# Altium schematic sheet MacSet-L-V2.0.0_2.SchDoc
size A4; SheetNumber: 2; SheetTotal: 3
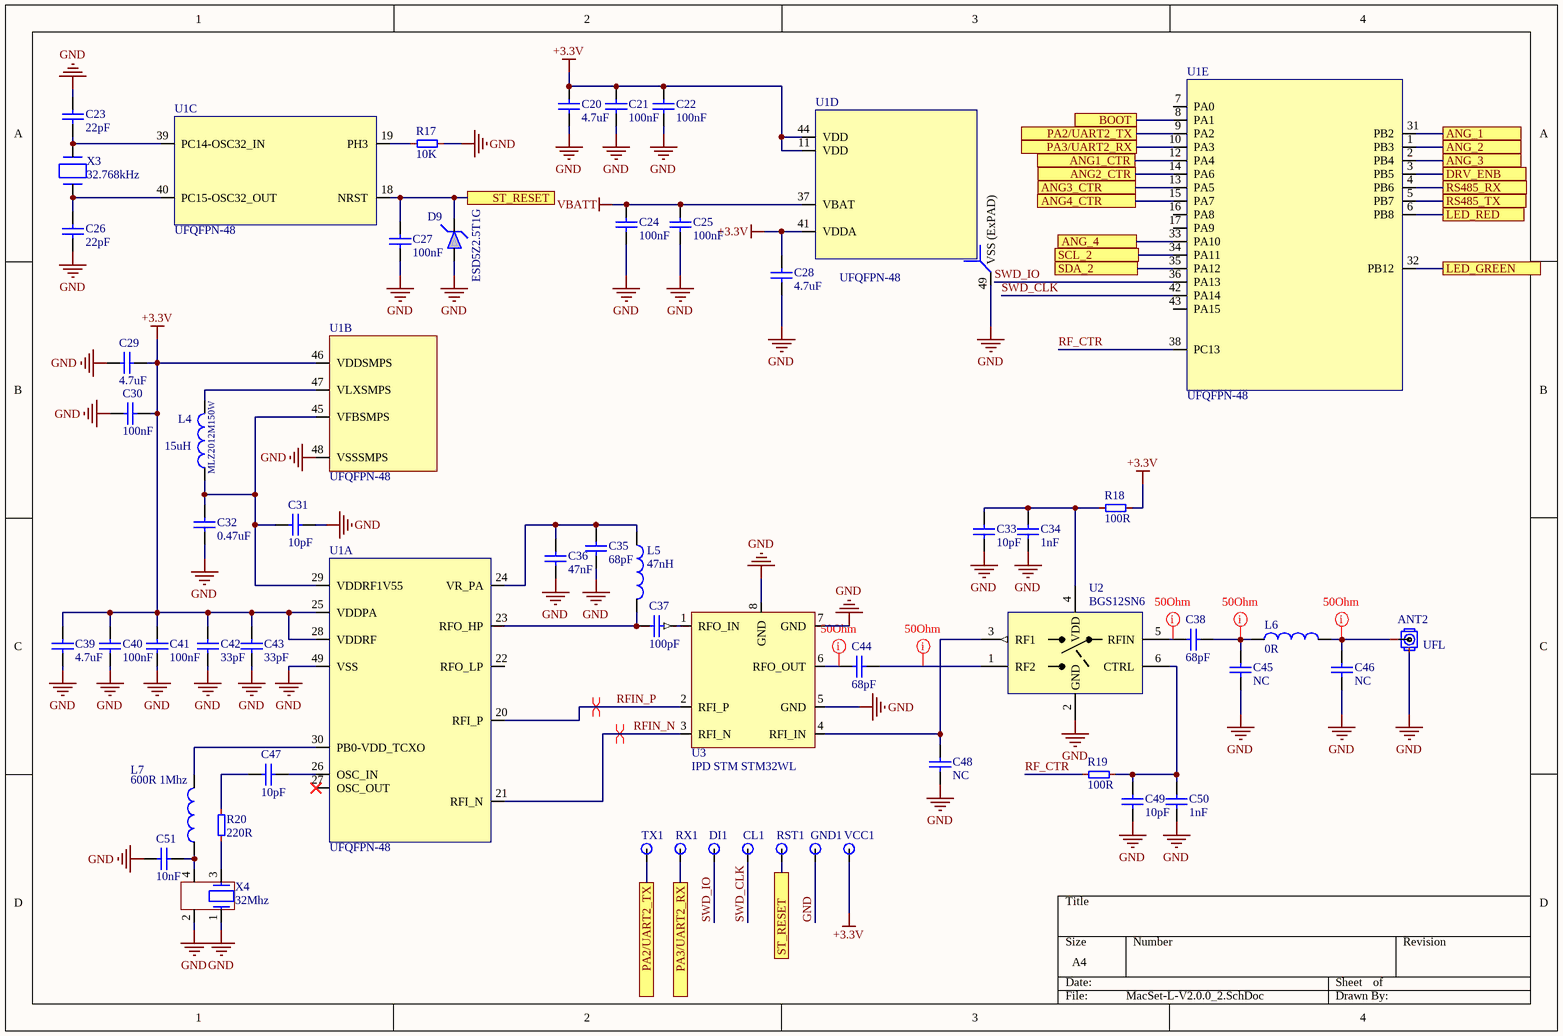
[diagram p0: MacSet-L-V2.0.0_2.SchDoc]

## Parts
ANT2  UFL  [UFL]
C20  4.7uF  [CAP0603]
C21  100nF  [CAP0402]
C22  100nF  [CAP0402]
C23  22pF  [CAP0402]
C24  100nF  [CAP0402]
C25  100nF  [CAP0402]
C26  22pF  [CAP0402]
C27  100nF  [CAP0402]
C28  4.7uF  [CAP0603]
C29  4.7uF  [CAP0603]
C30  100nF  [CAP0402]
C31  10pF  [CAP0402]
C32  0.47uF  [CAP0603]
C33  10pF  [CAP0402]
C34  1nF  [CAP0402]
C35  68pF  [CAP0402]
C36  47nF  [CAP0402]
C37  100pF  [CAP0402]
C38  68pF  [CAP0402]
C39  4.7uF  [CAP0603]
C40  100nF  [CAP0402]
C41  100nF  [CAP0402]
C42  33pF  [CAP0402]
C43  33pF  [CAP0402]
C44  68pF  [CAP0402]
C45  NC  [CAP0402]
C46  NC  [CAP0402]
C47  10pF  [CAP0402]
C48  NC  [CAP0402]  (net tie, no BOM)
C49  10pF  [CAP0402]
C50  1nF  [CAP0402]
C51  10nF  [CAP0402]
CL1  -  [TH_Pad]  (value not drawn)  (net tie, no BOM)
D9  ESD5Z2.5T1G  [SOD523]
DI1  -  [TH_Pad]  (value not drawn)  (net tie, no BOM)
GND1  -  [TH_Pad]  (value not drawn)  (net tie, no BOM)
L4  Manufacturer_Part_Number: MLZ2012M150W  [IND_2012]  (hidden comment: 15uH)
L5  47nH  [IND_0402]
L6  0R  [IND_0402]
L7  600R 1Mhz  [IND_0402]
R17  10K  [RESC0402]
R18  100R  [RESC0402]
R19  100R  [RESC0402]
R20  220R  [RESC0402]
RST1  -  [TH_Pad]  (value not drawn)  (net tie, no BOM)
RX1  -  [TH_Pad]  (value not drawn)  (net tie, no BOM)
TX1  -  [TH_Pad]  (value not drawn)  (net tie, no BOM)
U1  UFQFPN-48  [STM32WLxx_QFN48]  (parts A,B,C,D,E of 5)
U2  BGS12SN6  [SON40P70X40-6N]
U3  IPD STM STM32WL  [IPD STM]
VCC1  -  [TH_Pad]  (value not drawn)  (net tie, no BOM)
X3  32.768kHz  [OSC_3215]
X4  value 32Mhz  [OSC_2016]  (hidden comment: OSC_2016)

## Ports
ANG1_CTR (see MacSet-L-V2.0.0_1[1A]), ANG2_CTR (see MacSet-L-V2.0.0_1[1B]), ANG3_CTR (see MacSet-L-V2.0.0_1[1C]), ANG4_CTR (see MacSet-L-V2.0.0_1[1C]), ANG_1 (see MacSet-L-V2.0.0_1[2A]), ANG_2 (see MacSet-L-V2.0.0_1[2B]), ANG_3 (see MacSet-L-V2.0.0_1[2C]), ANG_4 (see MacSet-L-V2.0.0_1[2C]), BOOT (see MacSet-L-V2.0.0_1[3C]), DRV_ENB (see MacSet-L-V2.0.0_3[1A]), LED_GREEN (see MacSet-L-V2.0.0_1[3D]), LED_RED (see MacSet-L-V2.0.0_1[3D]), PA2/UART2_TX (see MacSet-L-V2.0.0_1[3C], MacSet-L-V2.0.0_2[2D]), PA2/UART2_TX (see MacSet-L-V2.0.0_1[3C], MacSet-L-V2.0.0_2[3A]), PA3/UART2_RX (see MacSet-L-V2.0.0_1[3B], MacSet-L-V2.0.0_2[2D]), PA3/UART2_RX (see MacSet-L-V2.0.0_1[3B], MacSet-L-V2.0.0_2[3A]), RS485_RX (see MacSet-L-V2.0.0_3[1A]), RS485_TX (see MacSet-L-V2.0.0_3[1B]), SCL_2 (see MacSet-L-V2.0.0_3[3C]), SDA_2 (see MacSet-L-V2.0.0_3[3B]), ST_RESET (see MacSet-L-V2.0.0_1[3B], MacSet-L-V2.0.0_2[2A]), ST_RESET (see MacSet-L-V2.0.0_1[3B], MacSet-L-V2.0.0_2[3D])

## Nets
+3.3V: C20.2 C21.1 C22.1 C28.2 C29.2 C30.1 C39.2 C40.1 C41.1 C42.1 C43.1 R18.1 U1.11(VDD) U1.25(VDDPA) U1.28(VDDRF) U1.41(VDDA) U1.44(VDD) U1.46(VDDSMPS) VCC1.1
GND: ANT2.2(Value) C20.1 C21.2 C22.2 C23.2 C24.2 C25.2 C26.1 C27.2 C28.1 C29.1 C30.2 C31.1 C32.1 C33.1 C34.1 C35.1 C36.1 C39.1 C40.2 C41.2 C42.2 C43.2 C45.1 C46.1 C48.2 C49.1 C50.1 C51.2 D9.2(A) GND1.1 R17.1 U1.48(VSSSMPS) U1.49(VSS_(ExPAD)) U2.2(GND) U3.5(GND) U3.7(GND) U3.8(GND) X4.1 X4.2
VBATT: C24.1 C25.1 U1.37(VBAT)
ANG1_CTR: U1.12(PA4) ; port ANG1_CTR
ANG2_CTR: U1.14(PA6) ; port ANG2_CTR
ANG3_CTR: U1.13(PA5) ; port ANG3_CTR
ANG4_CTR: U1.15(PA7) ; port ANG4_CTR
ANG_1: U1.31(PB2) ; port ANG_1
ANG_2: U1.1(PB3) ; port ANG_2
ANG_3: U1.2(PB4) ; port ANG_3
ANG_4: U1.33(PA10) ; port ANG_4
BOOT: U1.8(PA1) ; port BOOT
DRV_ENB: U1.3(PB5) ; port DRV_ENB
LED_GREEN: U1.32(PB12) ; port LED_GREEN
LED_RED: U1.6(PB8) ; port LED_RED
PA2/UART2_TX: TX1.1(RX) U1.9(PA2) ; port PA2/UART2_TX
PA3/UART2_RX: RX1.1 U1.10(PA3) ; port PA3/UART2_RX
RF_CTR: R19.1 U1.38(PC13)
RFIN_N: U1.21(RFI_N) U3.3(RFI_N)
RFIN_P: U1.20(RFI_P) U3.2(RFI_P)
RS485_RX: U1.4(PB6) ; port RS485_RX
RS485_TX: U1.5(PB7) ; port RS485_TX
SCL_2: U1.34(PA11) ; port SCL_2
SDA_2: U1.35(PA12) ; port SDA_2
ST_RESET: C27.1 D9.1(K) RST1.1 U1.18(NRST) ; port ST_RESET
SWD_CLK: CL1.1 U1.42(PA14)
SWD_IO: DI1.1 U1.36(PA13)
NetANT2_1: ANT2.1(Value) C46.2 L6.2
NetC23_1: C23.1 U1.39(PC14-OSC32_IN) X3.2(X2)
NetC26_2: C26.2 U1.40(PC15-OSC32_OUT) X3.1(X1)
NetC31_2: C31.2 C32.2 L4.1 U1.29(VDDRF1V55) U1.45(VFBSMPS)
NetC33_2: C33.2 C34.2 R18.2 U2.4(VDD)
NetC35_2: C35.2 C36.2 L5.1 U1.24(VR_PA)
NetC37_1: C37.1 U3.1(RFO_IN)
NetC37_2: C37.2 L5.2 U1.23(RFO_HP)
NetC38_1: C38.1 C45.2 L6.1
NetC38_2: C38.2 U2.5(RFIN)
NetC44_1: C44.1 U2.1(RF2)
NetC44_2: C44.2 U3.6(RFO_OUT)
NetC47_1: C47.1 R20.2
NetC47_2: C47.2 U1.26(OSC_IN)
NetC48_1: C48.1 U2.3(RF1) U3.4(RFI_IN)
NetC49_2: C49.2 C50.2 R19.2 U2.6(CTRL)
NetC51_1: C51.1 L7.1 X4.4
NetL4_2: L4.2 U1.47(VLXSMPS)
NetL7_2: L7.2 U1.30(PB0-VDD_TCXO)
NetR17_2: R17.2 U1.19(PH3)
NetR20_1: R20.1 X4.3

Not connected (* = marked no-connect by the designer): U1 7(PA0) 16(PA8) 17(PA9) 22(RFO_LP) 27(OSC_OUT)* 43(PA15)

## Layout directives
net class 50Ohm; rule Width Constraint [Pref Width = 0.254mm    Min Width = 0.254mm    Max Width = 0.254mm]: NetANT2_1, NetC38_1, NetC38_2, NetC44_1, NetC44_2
differential pair: RFIN_N, RFIN_P

## Library data of the parts
ANT2 = SMA Antenna: SMA Connector
C20 C28 C29 C39 = Capa_0603: MLCC - SMD/SMT 4.7 uF 16 VDC 10% 0603 X5R; Manufacturer_Part_Number: CL10A475KQ8NNNC; Manufacturer: Samsung Electro-Mechanics
C21 C22 C24 C25 C27 C30 C40 C41 = Capa_0402: Ceramic Capacitor X7R 0402 100nF 16V; Manufacturer_Part_Number: GRM155R71C104JA88D; Manufacturer: MURATA
C23 C26 = Capa_0402: Multilayer Ceramic Capacitors MLCC - SMD/SMT 50 V 22pF C0G 0402 5%; Manufacturer_Part_Number: GCM1555C1H220JA16D; Manufacturer: Murata
C31 C33 C47 C49 = Capa_0402: Multilayer Ceramic Capacitors MLCC - SMD/SMT 50 V 10pF C0G 0402 10%; Manufacturer_Part_Number: CC0402JRNPO9BN100; Manufacturer: YAGEO
C32 = Capa_0603: MLCC - SMD/SMT 0.47 uF 16 VDC 10% 0603 X5R; Manufacturer_Part_Number: CC0603KRX7R0BB474; Manufacturer: Yageo
C34 C50 = Capa_0402: Multilayer Ceramic Capacitors MLCC - SMD/SMT 50 V 1nF C0G 0402 10%; Manufacturer_Part_Number: CC0402KRX7R9BB102; Manufacturer: YAGEO
C35 C38 C44 = Capa_0402: Multilayer Ceramic Capacitors MLCC - SMD/SMT 50 V 68pF C0G 0402 5%; Manufacturer_Part_Number: CC0402JRNPO9BN680; Manufacturer: YAGEO
C36 = Capa_0402: Multilayer Ceramic Capacitors MLCC - SMD/SMT 50 V 47nF C0G 0402 10%; Manufacturer_Part_Number: 0402B473K500CT; Manufacturer: Walsin
C37 = Capa_0402: Multilayer Ceramic Capacitors MLCC - SMD/SMT 50 V 100pF C0G 0402 10%; Manufacturer_Part_Number: CC0402KRNPO9BN101; Manufacturer: YAGEO
C42 C43 = Capa_0402: Ceramic Capacitor C0G, NP0 0402 33pF 35V; Manufacturer_Part_Number: CC0402JRNPO9BN330; Manufacturer: MURATA
C45 C46 = Capa_0402: Multilayer Ceramic Capacitors MLCC - SMD/SMT 50 V 2.4pF C0G 0402 10%; Manufacturer_Part_Number: CC0402CRNPO9BN2R4; Manufacturer: YAGEO
C48 = Capa_0402: Manufacturer_Part_Number: -; Manufacturer: -
C51 = Capa_0402: Multilayer Ceramic Capacitors MLCC - SMD/SMT 50 V 10nF C0G 0402 10%; Manufacturer_Part_Number: CC0402KRX7R9BB103; Manufacturer: YAGEO
CL1 DI1 GND1 RST1 RX1 TX1 VCC1 = TH_PAD: Through Hole pad 1mm 0.5mm Hole
D9 = DIODE-ESD: ESD Protection Diodes / TVS Diodes 2.5V ESD Protection Unidirectional; Manufacturer: onsemi; Manufacturer_Part_Number: ESD5Z2.5T1G
L4 = MCD-01433: MLZ2012 Multilayer Shielded Inductor 15µH, ±5%; Manufacturer: TDK; Value: 15uH
L5 = Inductor: 47nH High frequency chip inductor ±5%  0402; Manufacturer_Part_Number: LQG15HN47NJ02D; Manufacturer: Murata
L6 = Inductor: Thick Film Resistors - SMD 1/16watt 0R 1% 0402 Commercial Use; Manufacturer_Part_Number: RC0402FR-070RL; Manufacturer: YAGIO
L7 = Inductor: 47nH High frequency chip inductor ±5%  0402; Manufacturer_Part_Number: GZ1005D601TF; Manufacturer: Murata
R17 = RES_0402: Thick Film Resistors - SMD 1/16watt 10Kohms 0402 1% Commercial Use; Manufacturer_Part_Number: CRCW040210K0FKEDC; Manufacturer: Vishay; Parameter 1: *
R18 R19 = RES_0402: Thin Film Resistors 100 OHM 1% 50PPM 1/1 6W 0402; Manufacturer_Part_Number: RC0402FR-07100RL; Manufacturer: YAGEO; Parameter 1: *
R20 = RES_0402: Thin Film Resistors 220 OHM 1% 50PPM 1/1 6W 0402; Manufacturer_Part_Number: 0402WGF2200TCE; Manufacturer: Royalohm; Parameter 1: *
U1 = STM32WLE5C8U6_O: ARM Microcontrollers - MCU Sub-GHz Wireless Microcontrollers. Arm Cortex-M4 a.48 MHz 64 Kbytes of Flash 20 K; Manufacturer: STMicroelectronics; Manufacturer_Part_Number: STM32WL5CCU6
U2 = BGS12SN6: DC switch - Ultra-Low  SPDT analog switch; Manufacturer: INFINEON; Manufacturer_Part_Number: BGS12SN6
U3 = IPD ST STM32WL: Manufacturer: STMICROELECTRONICS; Manufacturer_Part_Number: MLPF-WL-02D3
X3 = OSC_2012: Crystal Osc 3215 32.768kHz 12pF; Manufacturer_Part_Number: ECS-.327-12.5-34B-TR; Manufacturer: ECS; Value: 32.768kHz
X4 = OSC_2016: TCXO Oscillators TG2016SMN 32.0000M-MCGNNM0: TCXO 2.8V 3.3V 0.5PPM -40 85C NON O/E 1K TR; Manufacturer: Epson; Manufacturer_Part_Number: TG2016SMN 32.0000M-MCGNNM0